# EAGLE design sparkfun-photon_p1 (EAGLE 7.1.0)
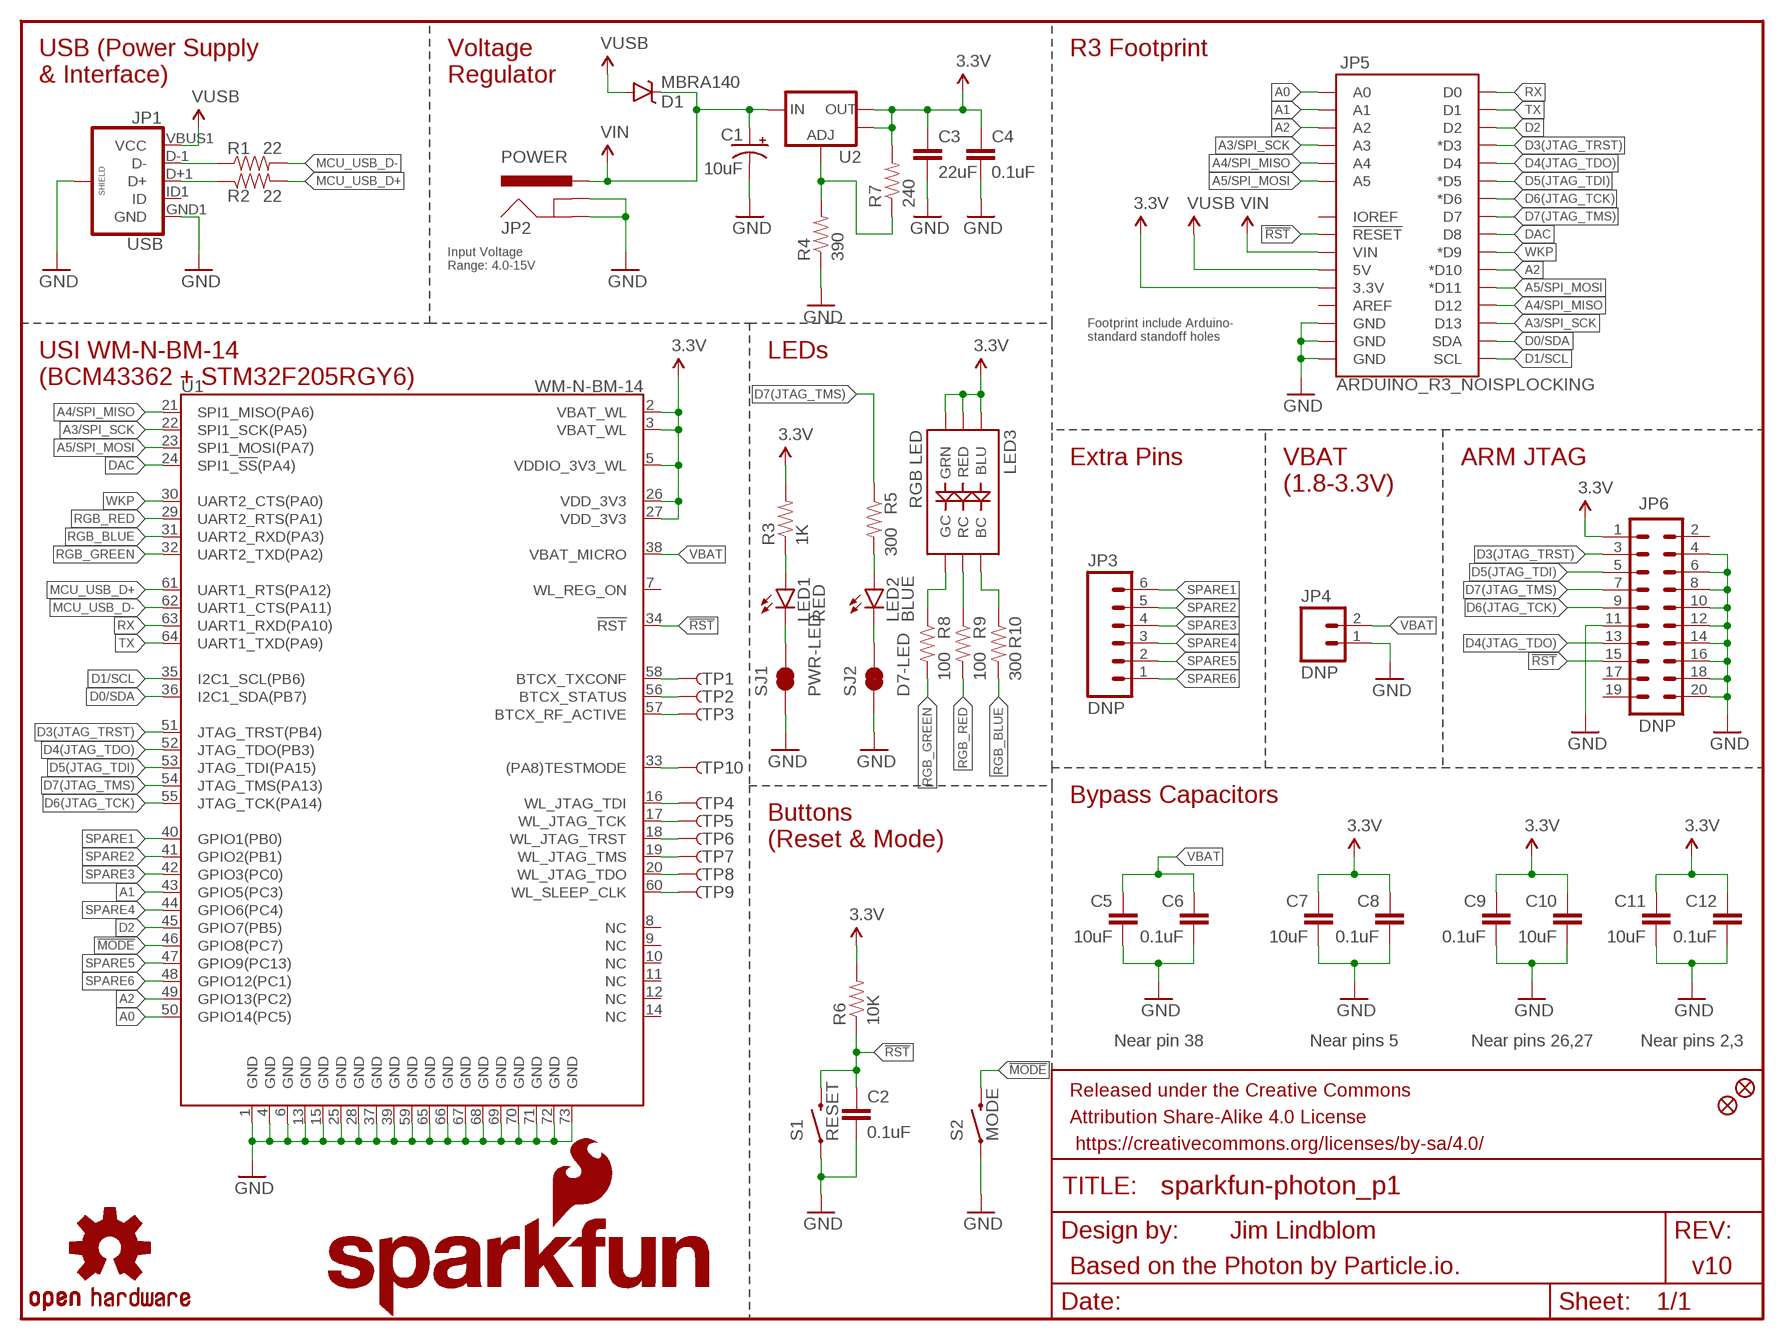
[diagram p0: schematic, sheet 1]

## Parts
C1  10uF  10UF-16V-10%(TANT)  [EIA3216]
C2  0.1uF  0.1UF-25V(+80/-20%)(0603)  [0603-CAP]
C3  22uF  22UF-6.3V-20%(0805)  [0805]
C4  0.1uF  0.1UF-25V(+80/-20%)(0603)  [0603-CAP]
C5  10uF  10UF-6.3V-20%(0603)  [0603-CAP]
C6  0.1uF  0.1UF-25V(+80/-20%)(0603)  [0603-CAP]
C7  10uF  10UF-6.3V-20%(0603)  [0603-CAP]
C8  0.1uF  0.1UF-25V(+80/-20%)(0603)  [0603-CAP]
C9  0.1uF  0.1UF-25V(+80/-20%)(0603)  [0603-CAP]
C10  10uF  10UF-6.3V-20%(0603)  [0603-CAP]
C11  10uF  10UF-6.3V-20%(0603)  [0603-CAP]
C12  0.1uF  0.1UF-25V(+80/-20%)(0603)  [0603-CAP]
D1  MBRA140  DIODE-SCHOTTKY-MBRA140  [SMA-DIODE]
FID1  FIDUCIAL1X2  [FIDUCIAL-1X2]
FID2  FIDUCIAL1X2  [FIDUCIAL-1X2]
FRAME1  FRAME-LETTER  [CREATIVE_COMMONS]
JP1  USB  USB_MICROB_PLUGCONN-11752  [USB-B-MICRO-SMD_V03]
JP2  POWER  POWER_JACKPTH_LOCK  [POWER_JACK_PTH_LOCK]
JP3  DNP  M06SILK_FEMALE_PTH  [1X06]
JP4  DNP  M02PTH  [1X02]
JP5  ARDUINO_R3_NOISPLOCKING  [ARDUINO_R3_NOISP_LOCKING]
JP6  DNP  M10X2  [2X10]
LED1  RED  LED-RED1206  [LED-1206]
LED2  BLUE  LED-BLUE1206  [LED-1206]
LED3  RGB LED  LED-TRICOLOR-NO-COMPLCC-6-SMD  [PLCC-6-LED]
LOGO1  OSHW-LOGOM  [OSHW-LOGO-M]
LOGO2  SFE_LOGO_NAME_FLAME.2_INCH  [SFE_LOGO_NAME_FLAME_.2]
LOGO3  SFE_LOGO_NAME_FLAME.4_INCH  [SFE_LOGO_NAME_FLAME_.4]
R1  22  22OHM1/10W1%(0603)  [0603-RES]
R2  22  22OHM1/10W1%(0603)  [0603-RES]
R3  1K  1KOHM-1/10W-1%(0603)  [0603-RES]
R4  390  390OHM1/10W1%(0603)  [0603-RES]
R5  300  300OHM-1/10W-1%(0603)  [0603-RES]
R6  10K  10KOHM-1/10W-1%(0603)0603  [0603-RES]
R7  240  240OHM1/10W1%(0603)  [0603-RES]
R8  100  100OHM-1/10W-1%(0603)  [0603-RES]
R9  100  100OHM-1/10W-1%(0603)  [0603-RES]
R10  300  300OHM-1/10W-1%(0603)  [0603-RES]
S1  RESET  SWITCH-MOMENTARY-2PTH  [TACTILE-PTH]
S2  MODE  SWITCH-MOMENTARY-2PTH  [TACTILE-PTH]
SJ1  PWR-LED  JUMPER-PAD-2-NC_BY_TRACE  [PAD-JUMPER-2-NC_BY_TRACE_YES_SILK]
SJ2  D7-LED  JUMPER-PAD-2-NC_BY_TRACE  [PAD-JUMPER-2-NC_BY_TRACE_YES_SILK]
TP1  TEST-POINTTP_15TH_THRU  [TP_15TH]
TP2  TEST-POINTTP_15TH_THRU  [TP_15TH]
TP3  TEST-POINTTP_15TH_THRU  [TP_15TH]
TP4  TEST-POINTTP_15TH_THRU  [TP_15TH]
TP5  TEST-POINTTP_15TH_THRU  [TP_15TH]
TP6  TEST-POINTTP_15TH_THRU  [TP_15TH]
TP7  TEST-POINTTP_15TH_THRU  [TP_15TH]
TP8  TEST-POINTTP_15TH_THRU  [TP_15TH]
TP9  TEST-POINTTP_15TH_THRU  [TP_15TH]
TP10  TEST-POINTTP_15TH_THRU  [TP_15TH]
U1  WM-N-BM-14  [WM-N-BM-14]
U2  V_REG_LM1117SOT223  [SOT223]

## Nets
3.3V: C3.1 C4.1 C7.1 C8.1 C9.1 C10.1 C11.1 C12.1 JP5.3.3V JP6.1 LED3.AB(BLU) LED3.AG(GRN) LED3.AR(RED) R3.2 R6.2 R7.2 U1.2(VBAT_WL) U1.3(VBAT_WL) U1.5(VDDIO_3V3_WL) U1.26(VDD_3V3) U1.27(VDD_3V3) U2.2(OUT) U2.4(OUT)
!MODE: S2.3 U1.46(GPIO8(PC7))
!RST: C2.1 JP5.RESET@1(!RESET!) JP6.15 R6.1 S1.3 U1.34(!RST!)
A0: JP5.A0 U1.50(GPIO14(PC5))
A1: JP5.A1 U1.43(GPIO5(PC3))
A2: JP5.A2 JP5.D10(*D10) U1.49(GPIO13(PC2))
A3/SPI_SCK: JP5.A3 JP5.D13 U1.22(SPI1_SCK(PA5))
A4/SPI_MISO: JP5.A4 JP5.D12 U1.21(SPI1_MISO(PA6))
A5/SPI_MOSI: JP5.A5 JP5.D11(*D11) U1.23(SPI1_MOSI(PA7))
BTCX_RF_ACTIVE: TP3.P$1 U1.57(BTCX_RF_ACTIVE)
BTCX_STATUS: TP2.P$1 U1.56(BTCX_STATUS)
BTCX_TXCONF: TP1.P$1 U1.58(BTCX_TXCONF)
D0/SDA: JP5.SDA U1.36(I2C1_SDA(PB7))
D1/SCL: JP5.SCL U1.35(I2C1_SCL(PB6))
D2: JP5.D2 U1.45(GPIO7(PB5))
D3(JTAG_TRST): JP5.D3(*D3) JP6.3 U1.51(JTAG_TRST(PB4))
D4(JTAG_TDO): JP5.D4 JP6.13 U1.52(JTAG_TDO(PB3))
D5(JTAG_TDI): JP5.D5(*D5) JP6.5 U1.53(JTAG_TDI(PA15))
D6(JTAG_TCK): JP5.D6(*D6) JP6.9 U1.55(JTAG_TCK(PA14))
D7(JTAG_TMS): JP5.D7 JP6.7 R5.1 U1.54(JTAG_TMS(PA13))
D+: JP1.D+1(D+) R2.1
D-: JP1.D-1(D-) R1.1
DAC: JP5.D8 U1.24(SPI1_!SS!(PA4))
GND: C1.C(-) C2.2 C3.2 C4.2 C5.2 C6.2 C7.2 C8.2 C9.2 C10.2 C11.2 C12.2 JP1.GND1(GND) JP1.SHIELD1(SHIELD) JP1.SHIELD2(SHIELD) JP1.SHIELD3(SHIELD) JP2.GND JP2.GNDBREAK JP4.1 JP5.GND@1(GND) JP5.GND@2(GND) JP5.GND@3(GND) JP6.4 JP6.6 JP6.8 JP6.10 JP6.11 JP6.12 JP6.14 JP6.16 JP6.18 JP6.20 R4.1 S1.1 S2.1 SJ1.1 SJ2.1 U1.1(GND) U1.4(GND) U1.6(GND) U1.13(GND) U1.15(GND) U1.25(GND) U1.28(GND) U1.37(GND) U1.39(GND) U1.59(GND) U1.65(GND) U1.66(GND) U1.67(GND) U1.68(GND) U1.69(GND) U1.70(GND) U1.71(GND) U1.72(GND) U1.73(GND)
MCU_USB_D+: R2.2 U1.61(UART1_RTS(PA12))
MCU_USB_D-: R1.2 U1.62(UART1_CTS(PA11))
N$1: TP10.P$1 U1.33((PA8)TESTMODE)
N$2: LED1.C SJ1.2
N$3: LED3.CG(GC) R8.1
N$4: LED3.CR(RC) R9.1
N$5: LED3.CB(BC) R10.1
N$6: LED1.A R3.1
N$7: LED2.A R5.2
N$8: LED2.C SJ2.2
N$15: R4.2 R7.1 U2.1(ADJ)
RGB_BLUE: R10.2 U1.31(UART2_RXD(PA3))
RGB_GREEN: R8.2 U1.32(UART2_TXD(PA2))
RGB_RED: R9.2 U1.29(UART2_RTS(PA1))
RX: JP5.D0 U1.63(UART1_RXD(PA10))
SPARE1: JP3.6 U1.40(GPIO1(PB0))
SPARE2: JP3.5 U1.41(GPIO2(PB1))
SPARE3: JP3.4 U1.42(GPIO3(PC0))
SPARE4: JP3.3 U1.44(GPIO6(PC4))
SPARE5: JP3.2 U1.47(GPIO9(PC13))
SPARE6: JP3.1 U1.48(GPIO12(PC1))
TX: JP5.D1 U1.64(UART1_TXD(PA9))
VBAT: C5.1 C6.1 JP4.2 U1.38(VBAT_MICRO)
VIN: C1.A(+) D1.C JP2.PWR JP5.VIN U2.3(IN)
VUSB: D1.A JP1.VBUS1(VCC) JP5.5V
WKP: JP5.D9(*D9) U1.30(UART2_CTS(PA0))
WL_JTAG_TCK: TP5.P$1 U1.17(WL_JTAG_TCK)
WL_JTAG_TDI: TP4.P$1 U1.16(WL_JTAG_TDI)
WL_JTAG_TDO: TP8.P$1 U1.20(WL_JTAG_TDO)
WL_JTAG_TMS: TP7.P$1 U1.19(WL_JTAG_TMS)
WL_JTAG_TRST: TP6.P$1 U1.18(WL_JTAG_TRST)
WL_SLEEP_CLK: TP9.P$1 U1.60(WL_SLEEP_CLK)
Unconnected: JP1.ID1(ID) JP5.AREF JP5.IOREF JP6.2 JP6.17 JP6.19 U1.7(WL_REG_ON) U1.8(NC) U1.9(NC) U1.10(NC) U1.11(NC) U1.12(NC) U1.14(NC)

## Notes on the sheet
- USB (Power Supply
  & Interface)
- Voltage
  Regulator
- R3 Footprint
- Input Voltage
  Range: 4.0-15V
- USI WM-N-BM-14
  (BCM43362 + STM32F205RGY6)
- LEDs
- Footprint include Arduino-
  standard standoff holes
- Extra Pins
- VBAT
  (1.8-3.3V)
- ARM JTAG
- Bypass Capacitors
- Buttons
  (Reset & Mode)
- Near pin 38 | Near pins 5 | Near pins 26,27 | Near pins 2,3
- Jim Lindblom
- Based on the Photon by Particle.io. | v10

## Library data of the parts
C1 = SparkFun-Capacitors:10UF-16V-10%(TANT): CAP-00811 1206/EIA-3216 Tantalum capacitor; PROD_ID: CAP-00811
C2 C4 C6 C8 C9 C12 = SparkFun-Capacitors:0.1UF-25V(+80/-20%)(0603): CAP-00810 Ceramic Standard decoupling cap; PROD_ID: CAP-00810
C3 = SparkFun-Capacitors:22UF-6.3V-20%(0805): CAP-08402 Ceramic; PROD_ID: CAP-08402
C5 C7 C10 C11 = SparkFun-Capacitors:10UF-6.3V-20%(0603): CAP-11015; PROD_ID: CAP-11015
D1 = SparkFun-DiscreteSemi:DIODE-SCHOTTKY: Schottky diodes in SFE's production catalog BAT20J 1A 23V 0.62Vf RB751 120mA 40V 0.37Vf PMEG4005EJ 0.5A 40V 0.42Vf MBRA140 1A 40V 0.5Vf B340A 3A 40V SMA; PROD_ID: DIO-08053
FID1 FID2 = SparkFun-Aesthetics:FIDUCIAL: Fiducial Alignment Points Various fiducial points for machine vision alignment.
FRAME1 = SparkFun-Aesthetics:FRAME-LETTER: Schematic Frame Standard 8.5x11 US Letter frame; DESIGNER: Jim Lindblom; VERSION: v01
JP1 = SparkFun-Connectors:USB_MICROB_PLUG: USB Micro-B connectors Some male, some female. Watch your step!; PROD_ID: CONN-11752
JP2 = SparkFun-Connectors:POWER_JACK: Power Jack This is the standard 5.5mm barrel jack for power. The PTH is the most common, proven, reliable, footprint. The Slot footprint only works if the mill layer is transmitted to the PCB fab house so be warned. Mating wall wart : TOL-00298 (and others); PROD_ID: CONN-08197; SF_ID: PRT-00119
JP3 = SparkFun-Connectors:M06: Header 6 Standard 6-pin 0.1" header. Use with straight break away headers (SKU : PRT-00116), right angle break away headers (PRT-00553), swiss pins (PRT-00743), machine pins (PRT-00117), and female headers (PRT-00115). Molex polarized connector foot print use with SKU : PRT-08094 with associated crimp pins and housings. NOTES ON THE VARIANTS LOCK and LOCK_LONGPADS... This footprint was designed to help hold the alignment of a through-hole component (i.e. 6-pin header) while soldering it into place. You may notice that each hole has been shifted either up or down by 0.005 of an inch from it's more standard position (which is a perfectly straight line). This slight alteration caused the pins (the squares in the middle) to touch the edges of the holes. Because they are alternating, it causes a "brace" to hold the component in place. 0.005 has proven to be the perfect amount of "off-center" position when using our standard breakaway headers. Although looks a little odd when you look at the bare footprint, once you have a header in there, the alteration is very hard to notice. Also,if you push a header all the way into place, it is covered up entirely on the bottom side. This idea of altering the position of holes to aid alignment will be further integrated into the Sparkfun Library for other footprints. It can help hold any component with 3 or more connection pins.; PROD_ID: CONN-08437
JP4 = SparkFun-Connectors:M02: Standard 2-pin 0.1" header. Use with - straight break away headers ( PRT-00116) - right angle break away headers (PRT-00553) - swiss pins (PRT-00743) - machine pins (PRT-00117) - female headers (PRT-00115) Molex polarized connector foot print use with: PRT-08233 with associated crimp pins and housings. 2.54_SCREWTERM for use with PRT-10571. 3.5mm Screw Terminal footprints for PRT-08084 5mm Screw Terminal footprints for use with PRT-08432
JP5 = sparkfun_photon_temp:ARDUINO_R3_NOISP
JP6 = SparkFun-Connectors:M10X2: This was SPECIALLY designed to be used with our Graphic LCD Backpack. Be sure you want to use this! It is not only staggered on each line of header holes, but IT IS ALSO offset of the center point of the top and bottom lines by 5 mil. This causes the headers to lock into place on the "standard" footprint on the LCD screen. The extra squares on the tdocu layer are there simply to reference other pins (if you were to actually populate a longer header than ten long - this is what we do with the backpacks).
LED1 = SparkFun-LED:LED-RED: Assorted Red LEDs LilyPad 1206- DIO-09912 1206- DIO-00809 0603- DIO-00819; PROD_ID: DIO-00809
LED2 = SparkFun-LED:LED-BLUE: Blue LEDs for production use Various blue LEDs stocked by SparkFun production 0603 - DIO-08575 Rebel - DIO-09553 1206 - DIO-09911; PROD_ID: DIO-09911
LED3 = SparkFun-LED:LED-TRICOLOR-NO-COM; PROD_ID: DIO-12113
LOGO1 = SparkFun-Aesthetics:OSHW-LOGO: Open Source Hardware Logo This logo indicates the piece of hardware it is found on incorporates a OSHW license and/or adheres to the definition of open source hardware found here: http://freedomdefined.org/OSHW
LOGO2 LOGO3 = SparkFun-Aesthetics:SFE_LOGO_NAME_FLAME: SFE Logo, name and flame This is the SparkFun full logo. The logo on the schematic will always be the same size; the package variant is the height of the flame part of the logo. Default layer for the logo on the board is tSilk.
R1 R2 = SparkFun-Resistors:22OHM1/10W1%(0603): RES-08698; PROD_ID: RES-08698
R3 = SparkFun-Resistors:1KOHM-1/10W-1%(0603): RES-07856; PROD_ID: RES-07856
R4 = SparkFun-Resistors:390OHM1/10W1%(0603): RES-07864; PROD_ID: RES-07864
R5 R10 = SparkFun-Resistors:300OHM-1/10W-1%(0603): RES-10328; PROD_ID: RES_10328
R6 = SparkFun-Resistors:10KOHM-1/10W-1%(0603): RES-00824; PROD_ID: RES-00824
R7 = SparkFun-Resistors:240OHM1/10W1%(0603): RES-07849; PROD_ID: RES-07849
R8 R9 = SparkFun-Resistors:100OHM-1/10W-1%(0603): RES-07863; PROD_ID: RES-07863
S1 S2 = SparkFun-Electromechanical:SWITCH-MOMENTARY-2: Various NO switches- pushbuttons, reed, etc; PROD_ID: SWCH-08441
SJ1 SJ2 = SparkFun-Passives:JUMPER-PAD-2-NC_BY_TRACE
TP1-TP10 = SparkFun-Passives:TEST-POINT: Bare copper test points for troubleshooting or ICT
U1 = sparkfun_photon_temp:WM-N-BM-14; PROD_ID: IC-12589
U2 = SparkFun-PowerIC:V_REG_LM1117: Voltage Regulator LM1117 Standard adjustable voltage regulator but in SMD form. Spark Fun Electronics SKU : COM-00595; PROD_ID: VREG-08170

## Net classes
0 default: width 0.203 mm

## Board
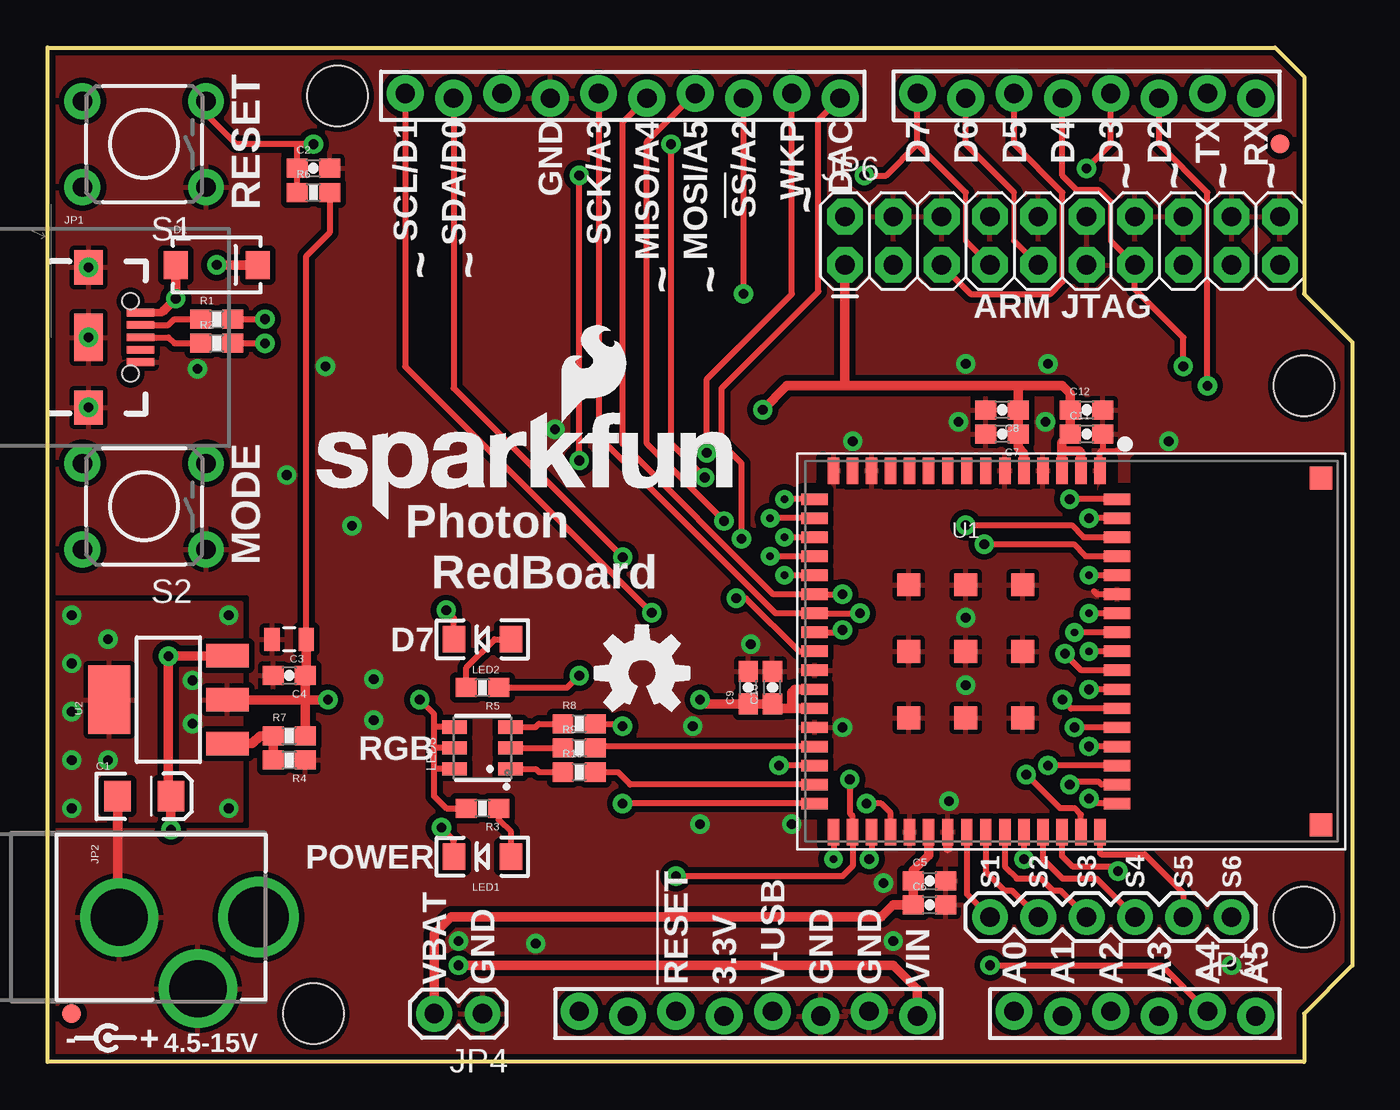
[diagram p1: board, top side]
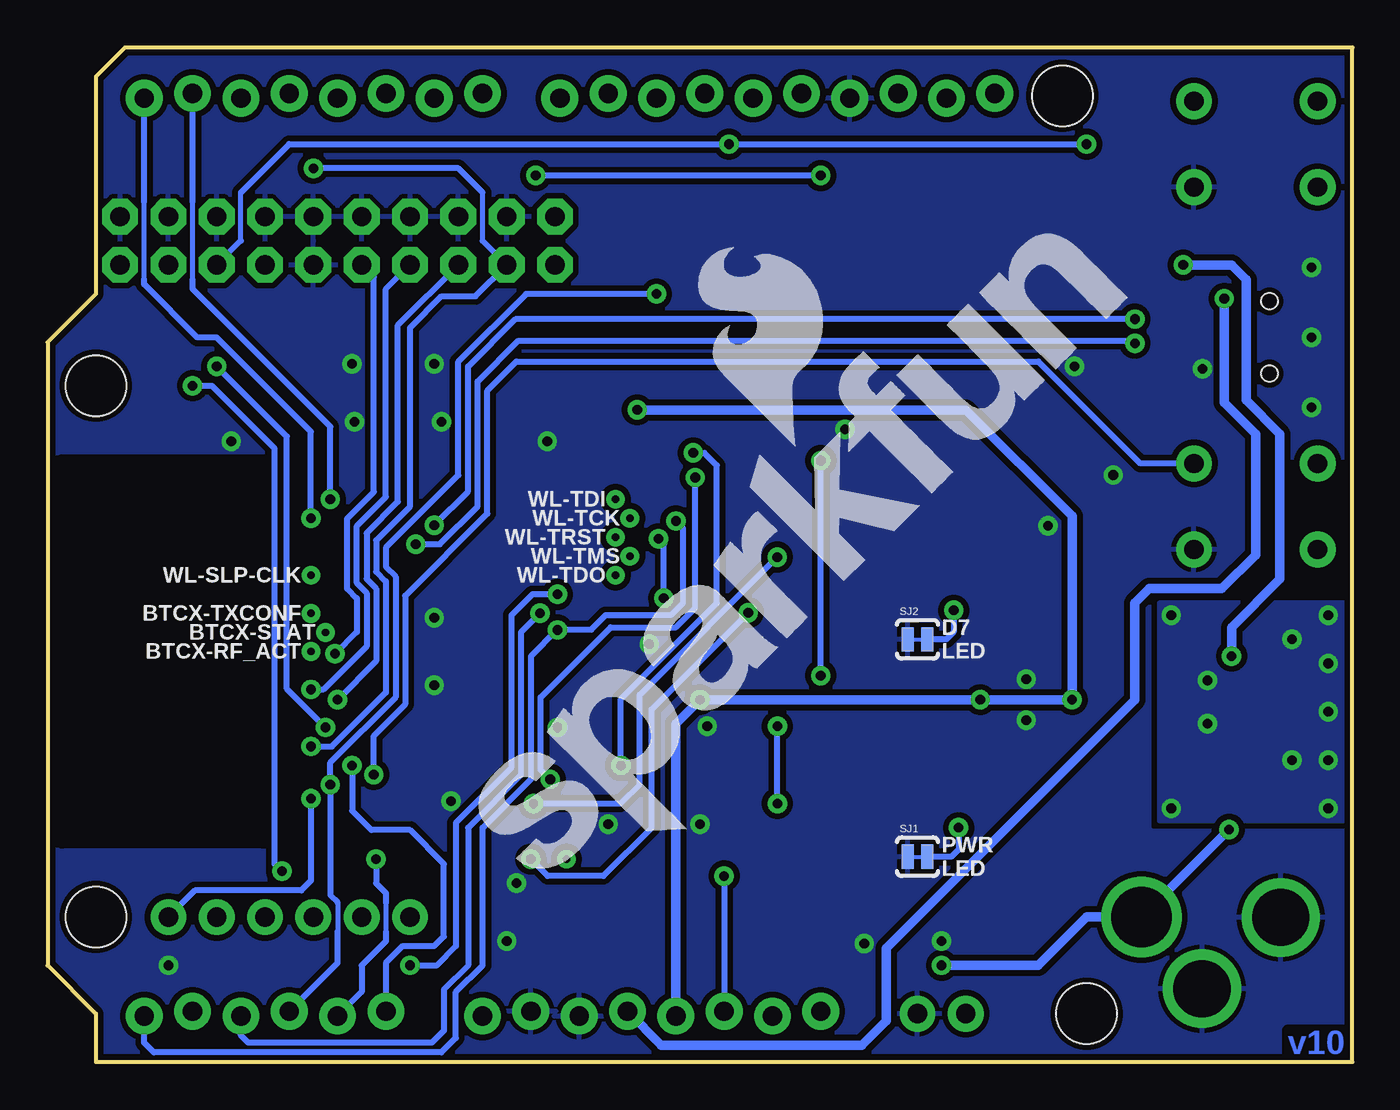
[diagram p2: board, bottom side, seen from below]

Size 68.58 x 53.34 mm. Coordinates in mm from the lower left corner, seen from the top.
Outline: 0,0 0,53.34 64.52,53.34 66.04,51.82 66.04,40.39 68.58,37.85 68.58,5.08 66.04,2.54 66.04,0 0,0
Copper layers (1*16): Top 0.035mm / dielectric 1.5mm / Bottom 0.035mm
Design rules "SparkFun-2-layer *": minimum track width 7mil, minimum drill 10mil, track to track 8mil, track to pad 8mil, pad to pad 8mil, via to via 8mil, smd to smd 8mil, copper to edge 8mil, drill to drill 8mil, minimum pad ring 12mil, minimum via ring 10mil, stop-mask expansion 4mil, vias tented up to drill 20mil, thermal gap 10mil

### Footprints (pad centres in the part's own frame; a part is rotated, then mirrored left to right if it is on the bottom)
EIA3216 = smd 1.4 x 1.6: A 1.4,0; C -1.4,0
0603-CAP = smd 1.1 x 1: 1 -0.85,0; 2 0.85,0
0805 = smd 0.8 x 1.2: 1 -0.9,0; 2 0.9,0
SMA-DIODE = smd 1.27 x 1.47: A -2.15,0; C 2.15,0
FIDUCIAL-1X2 = smd 1 x 1: 1 0,0
USB-B-MICRO-SMD_V03 = smd 1.45 x 0.4: D+1 2.725,0; D-1 2.725,0.65; GND1 2.725,-1.3; ID1 2.725,-0.65; VBUS1 2.725,1.3 | smd 1.5 x 1.8: SHIELD1 0,3.685; SHIELD2 0,-3.685 | smd 1.5 x 2.5: SHIELD3 0,0 | hole 0.85: 2.2,1.9; 2.2,-1.9
POWER_JACK_PTH_LOCK = drill 2.997 pad 4.115: GND 0.025,6.557; GNDBREAK 3.762,10.7 | drill 3.2 pad 4.115: PWR 0,13.878
1X06 = drill 1.016 pad 1.88: 1 0,0; 2 2.54,0; 3 5.08,0; 4 7.62,0; 5 10.16,0; 6 12.7,0
1X02 = drill 1.016 pad 1.88: 1 0,0; 2 2.54,0
ARDUINO_R3_NOISP_LOCKING = drill 1.016 pad 1.93: 3.3V 35.56,2.413; 5V 38.1,2.667; A0 50.8,2.667; A1 53.34,2.413; A2 55.88,2.667; A3 58.42,2.413; A4 60.96,2.667; A5 63.5,2.413; AREF 23.876,50.927; D0 63.5,50.673; D1 60.96,50.927; D2 58.42,50.673; D3 55.88,50.927; D4 53.34,50.673; D5 50.8,50.927; D6 48.26,50.673; D7 45.72,50.927; D8 41.656,50.673; D9 39.116,50.927; D10 36.576,50.673; D11 34.036,50.927; D12 31.496,50.673; D13 28.956,50.927; GND@1 40.64,2.413; GND@2 43.18,2.667; GND@3 26.416,50.673; IOREF 30.48,2.413; NC 27.94,2.667; RESET@1 33.02,2.667; SCL 18.796,50.927; SDA 21.336,50.673; VIN 45.72,2.413 | hole 3.175: 15.24,50.8; 66.04,35.56; 66.04,7.62; 13.97,2.54
2X10 = drill 1.016 pad 1.88 octagon: 1 -11.43,-1.27; 2 -11.43,1.27; 3 -8.89,-1.27; 4 -8.89,1.27; 5 -6.35,-1.27; 6 -6.35,1.27; 7 -3.81,-1.27; 8 -3.81,1.27; 9 -1.27,-1.27; 10 -1.27,1.27; 11 1.27,-1.27; 12 1.27,1.27; 13 3.81,-1.27; 14 3.81,1.27; 15 6.35,-1.27; 16 6.35,1.27; 17 8.89,-1.27; 18 8.89,1.27; 19 11.43,-1.27; 20 11.43,1.27
LED-1206 = smd 1.2 x 1.4: A -1.5,0; C 1.5,0
PLCC-6-LED = smd 0.7 x 1.3: AB -1.1,1.475; AG 1.1,1.475; AR 0,1.475; CB -1.1,-1.475; CG 1.1,-1.475; CR 0,-1.475
0603-RES = smd 1.1 x 1: 1 -0.85,0; 2 0.85,0
TACTILE-PTH = drill 1.016 pad 1.88: 1 -3.251,2.261; 2 3.251,2.261; 3 -3.251,-2.261; 4 3.251,-2.261
PAD-JUMPER-2-NC_BY_TRACE_YES_SILK = smd 0.635 x 1.27: 1 -0.508,0; 2 0.508,0
TP_15TH = drill 0.381 pad 0.61: P$1 0,0
WM-N-BM-14 = smd 0.6 x 1.4: 1 7.05,9.5; 2 6.05,9.5; 3 5.05,9.5; 4 4.05,9.5; 5 3.05,9.5; 6 2.05,9.5; 7 1.05,9.5; 8 0.05,9.5; 9 -0.95,9.5; 10 -1.95,9.5; 11 -2.95,9.5; 12 -3.95,9.5; 13 -4.95,9.5; 14 -5.95,9.5; 15 -6.95,9.5; 33 -6.95,-9.5; 34 -5.95,-9.5; 35 -4.95,-9.5; 36 -3.95,-9.5; 37 -2.95,-9.5; 38 -1.95,-9.5; 39 -0.95,-9.5; 40 0.05,-9.5; 41 1.05,-9.5; 42 2.05,-9.5; 43 3.05,-9.5; 44 4.05,-9.5; 45 5.05,-9.5; 46 6.05,-9.5; 47 7.05,-9.5 | smd 1.4 x 0.6: 16 -7.95,8; 17 -7.95,7; 18 -7.95,6; 19 -7.95,5; 20 -7.95,4; 21 -7.95,3; 22 -7.95,2; 23 -7.95,1; 24 -7.95,0; 25 -7.95,-1; 26 -7.95,-2; 27 -7.95,-3; 28 -7.95,-4; 29 -7.95,-5; 30 -7.95,-6; 31 -7.95,-7; 32 -7.95,-8; 48 7.95,-8; 49 7.95,-7; 50 7.95,-6; 51 7.95,-5; 52 7.95,-4; 53 7.95,-3; 54 7.95,-2; 55 7.95,-1; 56 7.95,0; 57 7.95,1; 58 7.95,2; 59 7.95,3; 60 7.95,4; 61 7.95,5; 62 7.95,6; 63 7.95,7; 64 7.95,8 | smd 1.2 x 1.2: 65 3,3.5; 66 0,3.5; 67 -3,3.5; 68 3,0; 69 0,0; 70 -3,0; 71 3,-3.5; 72 0,-3.5; 73 -3,-3.5; 74 18.67,-9.12; 75 18.67,9.12
SOT223 = smd 1.219 x 2.235: 1 -2.311,-3.099; 2 0,-3.099; 3 2.311,-3.099 | smd 3.6 x 2.2: 4 0,3.099

### Placement (x,y rotation side)
C1  5.08,13.97 0 top
C2  13.97,46.99 0 top
C3  12.7,22.23 180 top
C4  12.7,20.32 180 top
C5  46.35,9.53 0 top
C6  46.35,8.26 0 top
C7  50.16,33.02 180 top
C8  50.16,34.29 180 top
C9  36.83,19.68 90 top
C10  38.1,19.68 90 top
C11  54.61,33.02 0 top
C12  54.61,34.29 0 top
D1  8.89,41.91 0 top
FID1  64.77,48.26 0 top
FID2  1.27,2.54 0 top
FRAME1  15.24,-11.43 0 top  (outside the outline)
JP1  2.16,38.1 0 top
JP2  -2.79,7.62 270 top
JP3  62.23,7.62 180 top
JP4  22.86,2.54 180 top
JP5  0,0 0 top
JP6  53.34,43.18 0 top
LED1  22.86,10.79 180 top
LED2  22.86,22.23 180 top
LED3  22.86,16.51 90 top
LOGO1  31.24,20.45 0 top
LOGO2  13.46,28.45 0 top
LOGO3  40.64,6.35 45 bottom
R1  8.89,39.06 0 top
R2  8.89,37.79 0 top
R3  22.86,13.34 180 top
R4  12.7,15.88 180 top
R5  22.86,19.68 180 top
R6  13.97,45.72 0 top
R7  12.7,17.14 0 top
R8  27.94,17.78 0 top
R9  27.94,16.51 0 top
R10  27.94,15.24 0 top
S1  5.08,48.26 180 top
S2  5.08,29.21 180 top
SJ1  22.86,10.79 0 bottom
SJ2  22.86,22.23 0 bottom
TP1  54.74,23.59 180 top
TP2  54.74,21.59 180 top
TP3  53.98,22.59 180 top
TP4  38.73,29.59 0 top
TP5  37.97,28.59 270 top
TP6  38.73,27.59 0 top
TP7  37.97,26.59 0 top
TP8  38.73,25.59 0 top
TP9  54.74,25.59 0 bottom
TP10  41.31,10.67 0 top
U1  48.26,21.59 0 top
U2  6.35,19.05 90 top

### Tracks (layer width: path | path; a pad name or v marks a point on that pad's centre or on a via)
3.3V  (via drill 0.51)
  Top 0.305: 20.32,15.41 20.32,13.97 20.95,13.34 R3.2 | 20.32,15.41 20.32,16.51 | LED3.AG 20.36,17.61 20.32,17.65 | LED3.AB 20.32,15.41 | LED3.AR 20.32,16.51 | C3.1 13.6,42.38 14.82,43.6 R6.2 | 20.32,16.51 20.32,17.65 | 20.32,17.65 20.32,18.29 v19.56,19.05
  Top 0.508: 13.55,19.05 v14.73,19.05 | 41.91,35.56 JP6.1 | 13.55,19.05 C4.1 13.6,20.32 C3.1 | R7.2 13.55,19.05 | U1.5 51.31,32 51.02,32.3 C7.1 C8.1 51.02,35.56 | v37.59,34.29 38.86,35.56 41.91,35.56 | 41.91,35.56 51.02,35.56 | 51.02,35.56 53.34,35.56 53.76,35.14 C12.1 C11.1 53.31,32.57 53.31,32.13 | U1.3 53.31,32.13 | U1.2 54.31,32.05 54.23,32.13 53.31,32.13 | v34.29,19.05 34.51,18.84 C9.1 C10.1 38.34,18.59 38.99,18.59 | 38.99,18.59 U1.27 | U1.26 39.27,19.59 39.12,19.43 39.12,18.72 38.99,18.59 | U2.2 13.55,19.05
  Bottom 0.508: JP5.3.3V 35.56,17.78 v34.29,19.05 v19.56,19.05 v14.73,19.05 14.73,28.7 20.32,34.29 v37.59,34.29
  other vias: 1.27,23.5 1.27,20.95 1.27,18.41 1.27,15.88 1.27,13.34 3.17,22.23 3.17,15.88 7.62,20.07 7.62,17.78 9.53,23.5 9.53,13.34
  pour Top (isolate 0.305): 0,24.13 10.16,24.13 10.16,12.7 0,12.7
  pour Bottom (isolate 0.305): 0,24.13 10.16,24.13 10.16,12.7 0,12.7
!MODE  (via drill 0.51)
  Top 0.305: U1.46 54.31,13 53.98,13.34 53.21,13.34 v51.44,15.11
  Bottom 0.305: S2.3 11.15,31.47 16.51,36.83 43.94,36.83 45.47,35.31 45.47,28.83 49.78,24.51 49.78,18.8 51.44,17.14 v51.44,15.11
!RST  (via drill 0.51)
  Top 0.305: S1.3 8.33,49.84 9.91,48.26 13.12,48.26 | v13.97,48.26 13.12,48.26 | R6.1 C2.1 13.12,48.26 | v34.54,30.73 32.77,32.51 v32.77,48.26 | v42.16,14.86 42.16,13.08 42.31,12.94 U1.34 42.31,10.31 41.78,9.78 v33.02,9.78
  Bottom 0.254: 58.42,43.18 58.42,45.72
  Bottom 0.305: 58.42,45.72 55.88,48.26 v32.77,48.26 v13.97,48.26 | v33.02,9.78 JP5.RESET@1 | 58.42,43.18 JP6.15 | v42.16,14.86 42.67,15.37 42.67,19.18 38.99,22.86 35.56,22.86 34.54,23.88 v34.54,30.73
A0  (via drill 0.51)
  Top 0.305: U1.50 v52.58,15.59
  Bottom 0.305: v52.58,15.59 52.58,13.21 51.56,12.19 49.53,12.19 47.75,10.41 47.75,6.6 48.26,6.1 49.91,6.1 50.8,5.21 JP5.A0
A1  (via drill 0.51)
  Top 0.305: U1.43 v51.31,10.67
  Bottom 0.254: 50.8,8.38 50.8,6.86
  Bottom 0.305: v51.31,10.67 51.31,9.4 50.8,8.89 50.8,8.38 | JP5.A1 52.07,3.68 52.07,5.08 50.8,6.35 50.8,6.86
A2  (via drill 0.51)
  Top 0.305: JP5.D10 v36.58,40.39 | U1.49 55.39,14.59 55.24,14.73 53.86,14.73 v53.72,14.59
  Bottom 0.254: 53.34,8.38 53.34,6.86
  Bottom 0.305: 53.34,8.38 53.72,8.76 v53.72,14.59 53.72,15.75 50.29,19.18 50.29,25.53 50.8,26.04 50.8,27.05 46.99,30.86 46.99,36.83 43.43,40.39 v36.58,40.39 | JP5.A2 53.34,5.21 53.34,6.86
A3/SPI_SCK  (via drill 0.51)
  Top 0.305: v42.7,23.59 U1.22 38.26,23.59 28.96,32.89 JP5.D13
  Bottom 0.305: JP5.A3 58.42,1.4 58.04,1.02 48.39,1.02 47.75,1.65 47.75,3.81 46.48,5.08 46.48,12.32 43.69,15.11 43.69,22.61 v42.7,23.59
A4/SPI_MISO  (via drill 0.51)
  Top 0.305: v41.78,24.59 U1.21 38.15,24.59 30.23,32.51 30.23,49.4 JP5.D12 | v49.53,5.08 58.55,5.08 JP5.A4
  Bottom 0.305: v41.78,24.59 43.1,24.59 44.2,23.5 44.2,15.49 47.12,12.57 47.12,6.1 48.13,5.08 v49.53,5.08
A5/SPI_MOSI  (via drill 0.51)
  Top 0.305: v35.56,28.45 31.5,32.51 31.5,48.39 JP5.D11 | U1.23 41.66,22.59 v41.78,22.72
  Bottom 0.305: JP5.A5 63.5,1.02 62.99,0.51 47.88,0.51 47.12,1.27 47.12,3.68 45.72,5.08 45.72,12.32 43.18,14.86 43.18,21.34 41.78,22.73 | 41.78,22.73 v41.78,22.72 | 41.78,22.73 40.01,22.73 39.26,23.48 35.83,23.48 35.18,24.13 35.18,28.07 v35.56,28.45
BTCX_RF_ACTIVE
  Top 0.305: U1.57 TP3.P$1
BTCX_STATUS
  Top 0.305: U1.56 TP2.P$1
BTCX_TXCONF
  Top 0.305: U1.58 TP1.P$1
D0/SDA  (via drill 0.51)
  Top 0.305: JP5.SDA 21.34,35.43 v30.23,26.54 | U1.36 44.31,13.09 43.81,13.59 v43.04,13.59
  Bottom 0.305: v30.23,26.54 37.47,19.3 37.47,14.61 38.48,13.59 v43.04,13.59
D1/SCL  (via drill 0.51)
  Top 0.305: JP5.SCL 18.8,36.58 v31.75,23.62 | U1.35 43.31,10.79 v43.18,10.67
  Bottom 0.305: v31.75,23.62 36.83,18.54 36.83,12.32 39.37,9.78 42.29,9.78 v43.18,10.67
D2  (via drill 0.51)
  Top 0.254: 60.96,41.15 60.96,45.21
  Top 0.305: U1.45 53.31,10.82 53.85,10.29 56.01,10.29 v56.26,10.03 | JP5.D2 58.42,48.26 60.96,45.72 60.96,45.21 | v60.96,35.56 60.96,41.15
  Bottom 0.305: v56.26,10.03 56.64,10.41 56.64,32.26 59.94,35.56 v60.96,35.56
D3(JTAG_TRST)  (via drill 0.51)
  Top 0.305: U1.51 v54.74,16.59 | v54.61,46.99 55.88,48.26 JP5.D3
  Bottom 0.254: 45.72,43.18 45.72,45.72
  Bottom 0.305: 45.72,45.72 46.99,46.99 v54.61,46.99 | v54.74,16.59 53.64,16.59 50.8,19.43 50.8,25.27 51.31,25.78 51.31,27.43 49.53,29.21 49.53,38.61 47.88,40.26 46.1,40.26 JP6.3 45.72,43.18
D4(JTAG_TDO)  (via drill 0.51)
  Top 0.254: 55.88,43.18 55.88,45.21
  Top 0.305: v59.69,36.58 59.69,38.1 57.15,40.64 JP6.13 55.88,43.18 | U1.52 v53.98,17.59 | 55.88,45.21 55.24,45.85 54.1,45.85 53.34,46.61 JP5.D4
  Bottom 0.305: v53.98,17.59 56.01,19.62 56.01,32.89 v59.69,36.58
D5(JTAG_TDI)  (via drill 0.51)
  Top 0.254: 53.34,41.02 53.34,45.21
  Top 0.305: U1.53 53.8,18.59 v53.34,19.05 | 53.34,41.02 52.7,40.39 48.51,40.39 JP6.5 | 53.34,45.21 53.34,45.72 50.8,48.26 JP5.D5
  Bottom 0.305: JP6.5 50.16,38.73 50.16,29.46 51.82,27.81 51.82,25.4 51.31,24.89 51.31,21.08 v53.34,19.05
D6(JTAG_TCK)  (via drill 0.51)
  Top 0.254: 50.8,43.18 50.8,45.72
  Top 0.305: U1.55 54.34,20.59 v53.47,21.46 | 50.8,45.72 48.26,48.26 JP5.D6 | 50.8,43.18 JP6.9
  Bottom 0.305: v53.47,21.46 52.32,22.61 52.32,24.38 52.83,24.89 52.83,28.57 51.44,29.97 51.44,41.27 JP6.9
D7(JTAG_TMS)  (via drill 0.51)
  Top 0.254: 48.26,43.18 48.26,45.72
  Top 0.305: U1.54 v54.74,19.59 | 48.26,45.72 45.72,48.26 | 45.72,48.26 JP5.D7 | R5.1 27.3,19.68 v27.94,20.32 | v27.94,31.62 v27.94,46.61 | v42.93,46.61 44.07,46.61 45.72,48.26 | 48.26,43.18 JP6.7
  Bottom 0.305: v27.94,20.32 v27.94,31.62 | v27.94,46.61 v42.93,46.61 | JP6.7 50.8,40.64 50.8,29.72 52.32,28.19 52.32,25.18 51.82,24.67 51.82,21.84 54.07,19.59 v54.74,19.59
D+
  Top 0.305: JP1.D+1 6.35,38.1 6.66,37.79 R2.1
D-
  Top 0.305: JP1.D-1 6.35,38.75 6.66,39.06 R1.1
DAC  (via drill 0.51)
  Top 0.305: 40.64,21.59 U1.24 39.5,21.59 36.7,24.38 v36.2,24.38 | v36.47,27.51 36.47,31.47 35.43,32.51 35.43,35.43 40.51,40.51 40.51,49.53 JP5.D8
  Bottom 0.305: v36.2,24.38 36.2,27.23 v36.47,27.51
GND  (via drill 0.51)
  Top 0.305: U1.59 55.17,24.59 54.99,24.77 | U1.1 55.31,32.07 55.37,32.13 | 55.37,32.13 56.26,32.13 56.52,32.38 | C11.2 55.46,32.22 55.37,32.13
  Top 0.508: C1.C 3.68,7.68 JP2.GND | U1.39 47.31,11.24
  other vias: 2.16,34.42 2.16,41.78 2.16,38.1 48.26,23.37 48.26,19.81 7.87,36.45 14.61,36.58 42.32,32.64 47.88,33.66 52.58,36.7 58.93,32.64 43.94,9.4 47.37,13.72 52.45,33.66 33.91,17.65 62.23,5.08 36.96,21.97 41.78,17.59 39.12,12.51 34.29,12.51 48.26,36.7 44.45,6.35 17.14,20.13 17.14,17.97 25.65,6.22 21.59,6.35 12.57,30.86 16,28.19 26.67,33.27
  pour Bottom (isolate 0.305, rank 6): 0,0 0,53.34 64.52,53.34 66.04,51.82 66.04,40.39 68.58,37.85 68.58,32 68.58,11.13 68.58,5.08 66.04,2.54 66.04,0
  pour Top (isolate 0.305, rank 6): 0,0 0,53.34 64.52,53.34 66.04,51.82 66.04,40.39 68.58,37.85 68.58,32 68.58,11.13 68.58,5.08 66.04,2.54 66.04,0
MCU_USB_D+  (via drill 0.51)
  Top 0.305: R2.2 v11.43,37.79 | U1.61 54.56,26.59 53.93,27.23 v49.23,27.23
  Bottom 0.305: v11.43,37.79 11.56,37.92 43.84,37.92 45.97,35.79 45.97,29.21 47.96,27.23 v49.23,27.23
MCU_USB_D-  (via drill 0.51)
  Top 0.305: R1.2 v11.43,39.06 | U1.62 54.45,27.59 53.82,28.23 v48.26,28.23
  Bottom 0.305: v11.43,39.06 44,39.06 46.48,36.58 46.48,30 v48.26,28.23
N$1
  Top 0.305: U1.33 TP10.P$1
N$2  (via drill 0.51)
  Top 0.305: LED1.C 21.36,11.66 v20.7,12.32
  Bottom 0.305: v20.7,12.32 20.7,11.18 21.08,10.79 SJ1.2
N$3
  Top 0.305: LED3.CG 25.65,17.61 25.82,17.78 R8.1
N$4
  Top 0.305: LED3.CR R9.1
N$5
  Top 0.305: LED3.CB 25.65,15.41 25.82,15.24 R10.1
N$6
  Top 0.305: R3.1 23.71,12.74 24.36,12.09 LED1.A
N$7
  Top 0.305: R5.2 22.01,20.74 23.5,22.23 LED2.A
N$8  (via drill 0.51)
  Top 0.305: LED2.C 21.36,23.34 v20.95,23.75
  Bottom 0.305: v20.95,23.75 20.95,22.61 21.34,22.23 SJ2.2
N$15
  Top 0.508: 11.43,17.14 11.18,17.14 10.77,16.74 U2.1 | 11.43,17.14 R7.1 | R4.2 11.85,16.73 11.43,17.14
RGB_BLUE
  Top 0.305: R10.2 29.97,15.24 30.62,14.59 U1.31
RGB_GREEN  (via drill 0.51)
  Top 0.305: U1.32 v30.23,13.59 | R8.2 30.1,17.78 v30.23,17.65
  Bottom 0.305: v30.23,13.59 v30.23,17.65
RGB_RED
  Top 0.305: U1.29 28.87,16.59 R9.2
RX  (via drill 0.51)
  Top 0.305: U1.63 v54.74,28.59
  Bottom 0.254: 63.5,40.89 63.5,45.72
  Bottom 0.305: v54.74,28.59 54.74,33.15 59.69,38.1 60.71,38.1 63.5,40.89 63.5,41.15 | 63.5,45.21 63.5,45.72 JP5.D0
SPARE1
  Top 0.305: U1.40 48.31,8.84 JP3.6
SPARE2
  Top 0.305: U1.41 49.31,10 50.29,9.02 50.67,9.02 JP3.5
SPARE3
  Top 0.305: U1.42 50.31,10.27 50.93,9.65 52.2,9.65 52.83,9.02 53.21,9.02 JP3.4
SPARE4
  Top 0.305: U1.44 52.31,10.68 53.34,9.65 55.12,9.65 JP3.3
SPARE5
  Top 0.305: U1.47 55.31,10.98 55.37,10.92 57.66,10.92 59.69,8.89 JP3.2
SPARE6  (via drill 0.51)
  Top 0.305: U1.48 54.99,13.59 v54.74,13.84
  Bottom 0.305: v54.74,13.84 54.74,9.53 55.24,9.02 60.83,9.02 JP3.1
TX  (via drill 0.51)
  Top 0.305: U1.64 v53.72,29.59
  Bottom 0.254: 60.96,41.15 60.96,45.21
  Bottom 0.305: v53.72,29.59 53.72,33.4 60.96,40.64 60.96,41.15 | 60.96,45.21 JP5.D1
VBAT
  Top 0.508: JP4.2 20.32,6.73 21.21,7.62 43.81,7.62 44.45,8.26 C6.1 C5.1 45.51,10.07 46.31,10.88 U1.38
VIN  (via drill 0.51)
  Top 0.508: D1.C v8.89,41.91 | JP5.VIN 45.72,3.81 44.45,5.08 v21.59,5.08 | U2.3 9.43,21.34 v6.35,21.34 6.35,14.1 C1.A v6.48,12.22
  Bottom 0.508: v6.35,21.34 6.35,22.86 3.81,25.4 3.81,33.02 5.59,34.8 5.59,41.15 6.35,41.91 v8.89,41.91 | v21.59,5.08 16.51,5.08 13.97,7.62 JP2.PWR v6.48,12.22
VUSB  (via drill 0.51)
  Top 0.406: JP1.VBUS1 6,39.4 6.1,39.5
  Top 0.508: 6.1,39.5 v6.74,40.14 D1.A
  Bottom 0.508: JP5.5V 36.32,0.89 25.78,0.89 24.51,2.16 24.51,5.97 11.43,19.05 11.43,24.13 10.67,24.89 6.86,24.89 5.08,26.67 5.08,33.02 6.74,34.68 v6.74,40.14
WKP  (via drill 0.51)
  Top 0.305: U1.30 v38.45,15.59 | v34.65,32.03 34.65,35.92 39.12,40.39 JP5.D9
  Bottom 0.305: v38.45,15.59 38.45,19.08 33.4,24.13 33.4,31.37 34.06,32.03 v34.65,32.03
WL_JTAG_TCK
  Top 0.305: U1.17 TP5.P$1
WL_JTAG_TDI
  Top 0.305: U1.16 TP4.P$1
WL_JTAG_TDO
  Top 0.305: U1.20 TP8.P$1
WL_JTAG_TMS
  Top 0.305: U1.19 TP7.P$1
WL_JTAG_TRST
  Top 0.305: U1.18 TP6.P$1
WL_SLEEP_CLK
  Top 0.305: U1.60 TP9.P$1

### Text on the board
Bottom: v10
tPlace: SCL/D1 | SDA/D0 | GND | SCK/A3 | MISO/A4 | MOSI/A5 | !SS!/A2 | WKP | DAC | D7 | D6 | D5 | D4 | D3 | D2 | TX | RX | RESET | ~ | ~ | ~ | ~ | ~ | ~ | ~ | ~ | ~ | ARM JTAG | MODE | Photon / RedBoard | D7 | RGB | POWER | S1 | S2 | S3 | S4 | S5 | S6 | VBAT | GND | !RESET | 3.3V | V-USB | GND | GND | VIN | A0 | A1 | A2 | A3 | A4 | A5 | - | + | 4.5-15V
bPlace: WL-TDI | WL-TCK | WL-TRST | WL-TMS | WL-TDO | WL-SLP-CLK | BTCX-TXCONF | BTCX-STAT | D7 / LED | BTCX-RF_ACT | PWR / LED
tDocu: Jim Lindblom | Based on the Particle Photon, by Particle.io